# EAGLE schematic FSK_v2 (EAGLE 6.5.0)
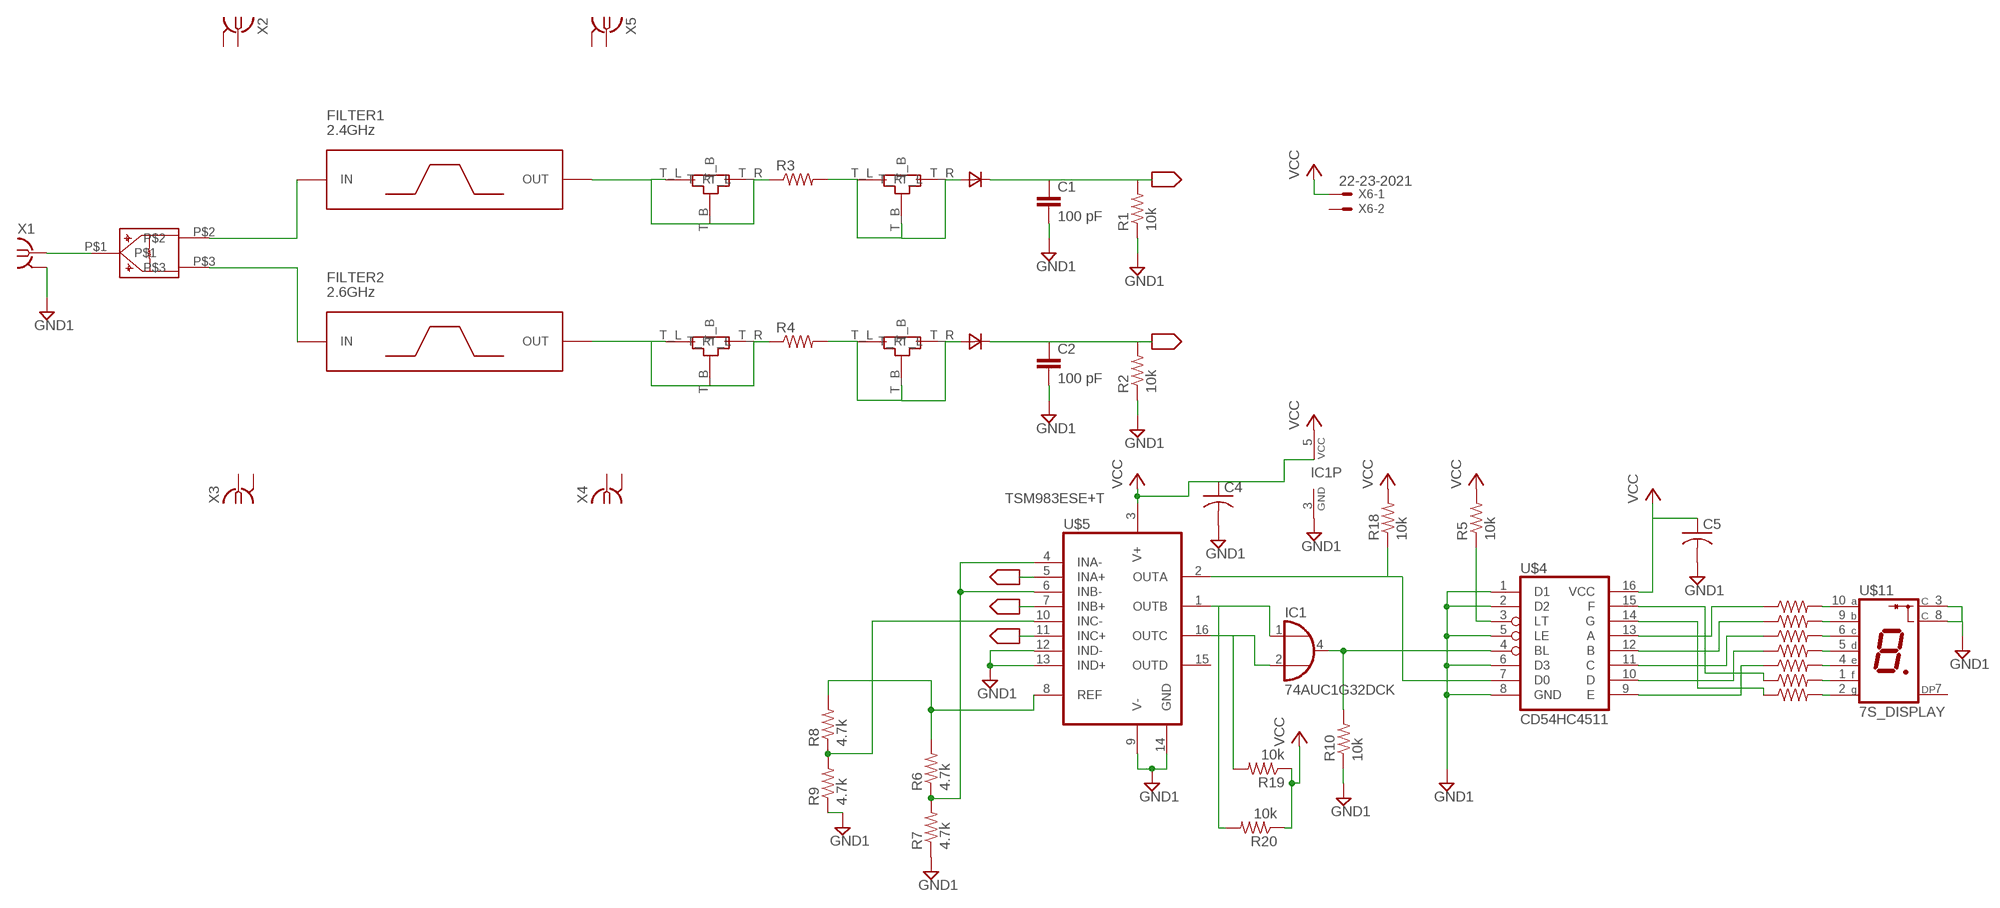
[diagram p0: schematic, sheet 1]

## Parts
2.4FIL  TEE_TL1  [TEE_TL1]
2.4TUNED  TEE_TL1  [TEE_TL1]
2.6FIL  TEE_TL1  [TEE_TL1]
2.6TUNED  TEE_TL1  [TEE_TL1]
C1  100 pF  C-EUC0603  [C0603]
C2  100 pF  C-EUC0603  [C0603]
C4  C-USC0603  [C0603]
C5  C-USC0603  [C0603]
FILTER1  2.4GHz  1IN_PIPE_CAP  [1IN_PIPE_CAP]
FILTER2  2.6GHz  1IN_PIPE_CAP  [1IN_PIPE_CAP]
IC1  74AUC1G32DCK  [SC70-5]
R1  10k  R-US_M1206  [M1206]
R2  10k  R-US_M1206  [M1206]
R3  R-US_R0603  [R0603]
R4  R-US_R0603  [R0603]
R5  10k  R-US_R1206  [R1206]
R6  4.7k  R-US_R1206  [R1206]
R7  4.7k  R-US_R1206  [R1206]
R8  4.7k  R-US_R1206  [R1206]
R9  4.7k  R-US_R1206  [R1206]
R10  10k  R-US_R1206  [R1206]
R11  R-US_R0603  [R0603]
R12  R-US_R0603  [R0603]
R13  R-US_R0603  [R0603]
R14  R-US_R0603  [R0603]
R15  R-US_R0603  [R0603]
R16  R-US_R0603  [R0603]
R17  R-US_R0603  [R0603]
R18  10k  R-US_R1206  [R1206]
R19  10k  R-US_R1206  [R1206]
R20  10k  R-US_R1206  [R1206]
U$1  WSPLITTER_2.5GHZ  [WSPLITTER_2.5GHZ]
U$2  HSMS-2850  [HSMS-2850]
U$3  HSMS-2850  [HSMS-2850]
U$4  CD54HC4511  [CD54HC4511]
U$5  TSM983ESE+T  [TSM983ESE+T]
U$11  7S_DISPLAY  [7S_DISPLAY]
X1  SMA-142-0711-821/826  [J502-ND-142-0711-821/826]
X2  SMA-142-0711-821/826  [J502-ND-142-0711-821/826]
X3  SMA-142-0711-821/826  [J502-ND-142-0711-821/826]
X4  SMA-142-0711-821/826  [J502-ND-142-0711-821/826]
X5  SMA-142-0711-821/826  [J502-ND-142-0711-821/826]
X6  22-23-2021  [22-23-2021]

## Nets
2.4_OUT: C1.1 R1.2 U$2.C U$5.5(INA+)
2.4FIL: 2.4FIL.T_B 2.4FIL.T_L 2.4FIL.T_R FILTER1.OUT R3.1
2.4GHZ: FILTER1.IN U$1.P$2
2.4TUNED: 2.4TUNED.T_B 2.4TUNED.T_L 2.4TUNED.T_R R3.2 U$2.A
2.6_OUT: C2.1 R2.2 U$3.C U$5.7(INB+) U$5.11(INC+)
2.6FIL: 2.6FIL.T_B 2.6FIL.T_L 2.6FIL.T_R FILTER2.OUT R4.1
2.6GHZ: FILTER2.IN U$1.P$3
2.6TUNED: 2.6TUNED.T_B 2.6TUNED.T_L 2.6TUNED.T_R R4.2 U$3.A
GND1: C1.2 C2.2 C4.2 C5.2 IC1.3(GND) R1.1 R2.1 R7.1 R9.1 R10.1 U$4.1(D1) U$4.2(D2) U$4.5(LE) U$4.6(D3) U$4.8(GND) U$5.9(V-) U$5.12(IND-) U$5.13(IND+) U$5.14(GND) U$11.3(C) U$11.8(C) X1.G@1 X1.G@2 X1.G@3 X1.G@4
N$1: IC1.4(O) R10.2 U$4.4(BL)
N$2: IC1.1(I0) R20.2 U$5.1(OUTB)
N$3: R11.2 U$11.10(A)
N$4: R12.2 U$11.9(B)
N$5: U$1.P$1 X1.1
N$6: R18.1 U$4.7(D0) U$5.2(OUTA)
N$7: R13.2 U$11.6(C)
N$8: IC1.2(I1) R19.2 U$5.16(OUTC)
N$9: R8.1 R9.2 U$5.10(INC-)
N$10: R6.2 R8.2 U$5.8(REF)
N$11: R6.1 R7.2 U$5.4(INA-) U$5.6(INB-)
N$12: R5.1 U$4.3(LT)
N$13: R14.2 U$11.5(D)
N$14: R15.2 U$11.4(E)
N$15: R16.2 U$11.1(F)
N$16: R17.2 U$11.2(G)
N$17: R11.1 U$4.13(A)
N$18: R12.1 U$4.12(B)
N$19: R13.1 U$4.11(C)
N$20: R14.1 U$4.10(D)
N$21: R15.1 U$4.9(E)
N$22: R16.1 U$4.15(F)
N$23: R17.1 U$4.14(G)
VCC: C4.1 C5.1 IC1.5(VCC) R5.2 R18.2 R19.1 R20.1 U$4.16(VCC) U$5.3(V+) X6.1
Unconnected: U$5.15(OUTD) U$11.7(DP) X2.1 X2.G@1 X2.G@2 X2.G@3 X2.G@4 X3.1 X3.G@1 X3.G@2 X3.G@3 X3.G@4 X4.1 X4.G@1 X4.G@2 X4.G@3 X4.G@4 X5.1 X5.G@1 X5.G@2 X5.G@3 X5.G@4 X6.2

## Library data of the parts
2.4FIL 2.4TUNED 2.6FIL 2.6TUNED = ECE532_Parts:TEE_TL1
C1 C2 = rcl:C-EU: CAPACITOR, European symbol
C4 C5 = rcl:C-US: CAPACITOR, American symbol
FILTER1 FILTER2 = ECE532_Parts:1IN_PIPE_CAP
IC1 = 74xx-little-de:74*1G32: 2-input OR gate
R1-R20 = rcl:R-US_: RESISTOR, American symbol
U$1 = ECE532_Parts:WSPLITTER_2.5GHZ
U$2 U$3 = ECE532_Parts:HSMS-2850
U$4 = ECE532_Parts:CD54HC4511
U$5 = ECE532_Parts:TSM983ESE+T
U$11 = ECE532_Parts:7S_DISPLAY
X1-X5 = con-coax:SMA-: SMA 50 Ohm End Launch Jack Receptacle - Round Contact Johnson Components Source: www.johnsoncomponents.com .. J502-ND.pdf; MF: JOHNSON COMPONENTS; MPN: 142-0711-821; OC_FARNELL: 1019328; OC_NEWARK: 16F3627
X6 = con-molex:22-23-2021: .100" (2.54mm) Center Header - 2 Pin; MF: MOLEX; MPN: 22-23-2021; OC_FARNELL: 1462926; OC_NEWARK: 25C3832